# Altium project Acoustics Single Channel.PrjPcb
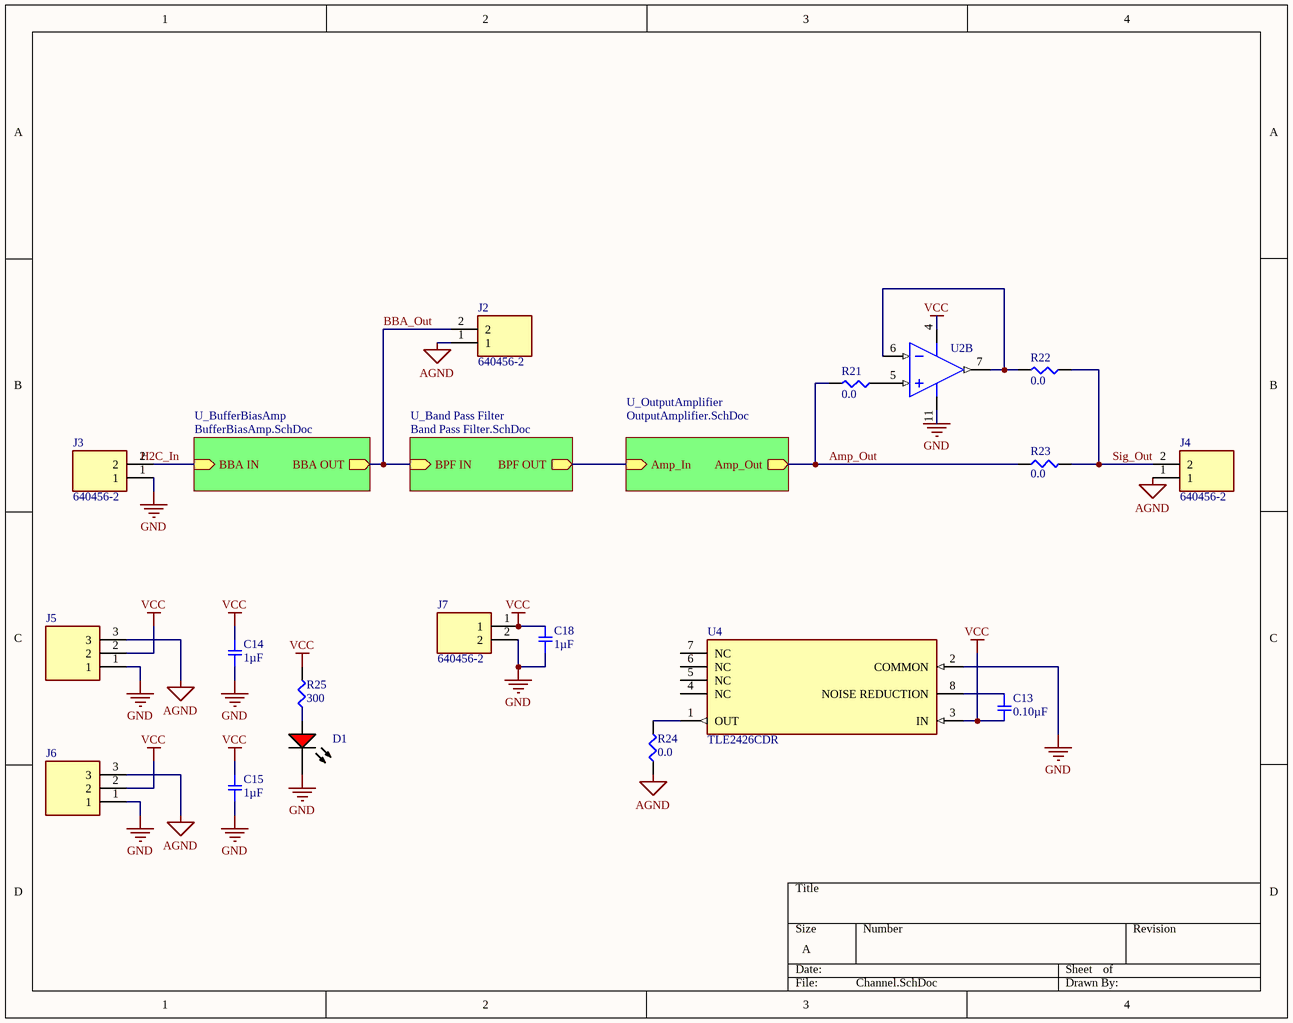
[diagram p0: Channel.SchDoc]
4 sheets, 56 parts. Net scope: hierarchical (ports join the sheet entries above them; power ports are global).
Board file: AcousticsSingleChannel.PcbDoc
Sheets:
  Channel.SchDoc
    U_OutputAmplifier = OutputAmplifier.SchDoc
    U_Band Pass Filter = Band Pass Filter.SchDoc
    U_BufferBiasAmp = BufferBiasAmp.SchDoc

## Sheet Channel.SchDoc
size A; SheetNumber: 1; SheetTotal: 4

### Parts
C13  0.10µF  [SMD-0603C]
C14  1µF  [SMD-0603C]
C15  1µF  [SMD-0603C]
C18  1µF  [SMD-0603C]
D1  TLMS1100-GS08  [VISH-TLMX1100_V]  (value not drawn)
J2  640456-2  [TE_640456-2]
J3  640456-2  [TE_640456-2]
J4  640456-2  [TE_640456-2]
J5  TSW-103-07-L-S  [TSW-103-XX-YY-S]  (value not drawn)
J6  TSW-103-07-L-S  [TSW-103-XX-YY-S]  (value not drawn)
J7  640456-2  [TE_640456-2]
R21  0.0  [SMD-0603-RES]
R22  0.0  [SMD-0603-RES]
R23  0.0  [SMD-0603-RES]
R24  0.0  [SMD-0603-RES]
R25  300  [SMD-0603-RES]
U2  OPA1604AIPWR  [PW0014A_N]  (value not drawn)  (part B of 4)
U4  TLE2426CDR  [FP-D0008A-IPC_B]

### Sub-sheets
U_Band Pass Filter = Band Pass Filter.SchDoc: BPF IN (in), BPF OUT (out)
U_BufferBiasAmp = BufferBiasAmp.SchDoc: BBA IN (in), BBA OUT (out)
U_OutputAmplifier = OutputAmplifier.SchDoc: Amp_In (in), Amp_Out (out)

### Nets
AGND: J2.1 J4.1 J5.3 J6.3 R24.1
GND: C14.1 C15.1 C18.1 D1.2(K) J3.1 J5.1 J6.1 J7.2 U2.11(V-) U4.2(COMMON)
VCC: C13.2 C14.2 C15.2 C18.2 J5.2 J6.2 J7.1 R25.2 U2.4(V+) U4.3(IN)
Amp_Out: R21.2 R23.1 ; sheet U_OutputAmplifier/Amp_Out
BBA_Out: J2.2 ; sheet U_Band Pass Filter/BPF IN, sheet U_BufferBiasAmp/BBA OUT
F4_Out: sheet U_OutputAmplifier/Amp_In, sheet U_Band Pass Filter/BPF OUT
H2C_In: J3.2 ; sheet U_BufferBiasAmp/BBA IN
Sig_Out: J4.2 R22.1 R23.2
NetC13_1: C13.1 U4.8(NOISE_REDUCTION)
NetD1_1: D1.1(A) R25.1
NetR21_1: R21.1 U2.5(IN_B+)
NetR22_2: R22.2 U2.6(IN_B-) U2.7(OUT_B)
NetR24_2: R24.2 U4.1(OUT)

Not connected (* = marked no-connect by the designer): U4 4(NC) 5(NC) 6(NC) 7(NC)

### Notes on the sheet
- Labels drawn without touching a wire or pin: H2C_In

### Library data of the parts
C13 = GCJ188R71C104KA01D: CAP CER 0.1UF 16V X7R 0603; Manufacturer: Samsung Electro-Mechanics; Manufacturer Part Number: CL10B104KB8NNWC; Value: 0.10µF; Operating Temperature: -55°C ~ 125°C; Package / Case: 0603 (1608 Metric); Datasheet Link: https://www.digikey.com/en/products/detail/samsung-electro-mechanics/CL10B104KB8NNWC/3887593
C14 C15 C18 = GCM188R71C105KA64D: CAP CER 1UF 16V X7R 0603; Manufacturer: Samsung Electro-Mechanics; Manufacturer Part Number: CL10A105KA8NNNC; Value: 1µF; Operating Temperature: -55°C ~ 125°C; Package / Case: 0603 (1608 Metric); Datasheet Link: https://www.digikey.com/en/products/detail/samsung-electro-mechanics/CL10A105KA8NNNC/3886760
D1 = CMP-1666-00027-1: LED, RED, 2.1 V, -40 to 100 degC, 2-Pin SMD (0603), RoHS, Tape and Reel; Manufacturer: Wurth Elektronics; Manufacturer Part Number: 150080SS75000; Value: 1.9V; Datasheet Link: https://www.mouser.com/ProductDetail/Wurth-Elektronik/150080SS75000?qs=LlUlMxKIyB2zzpiaOzrUdw%3D%3D&mgh=1&gclid=Cj0KCQjwm6KUBhC3ARIsACIwxBhChbj4MsdASq_HKZ9IIHp_SBsI6cWeNQVHWnPWPX4ZaUjtoXFUdFUaAm30EALw_wcB; Operating Temperature: -40to85degC; Package / Case: 0805 (2012 Metric); RoHS: Pb-Free
J2 J4 J7 = 640456-2: Connector Header Through Hole 2 position 0.100 _2.54mm_; MF: TE Connectivity; Package: None; Availability: Unavailable; TE_purchase_URL: https://www.te.com/usa-en/product-640456-2.html?te_bu=Cor&te_type=disp&te_campaign=seda_glo_cor-seda-global-disp-prtnr-fy19-seda-model-bom-cta_sma-317_1&elqCampaignId=32493; MP: 640456-2; Value: *; EU_RoHS_Compliance: Compliant; SnapEDA_Link: https://www.snapeda.com/parts/640456-2/TE%20Connectivity%20AMP%20Connectors/view-part/1957547/?ref=snap; Price: None
J3 = 640456-2: Connector Header Through Hole 2 position 0.100 _2.54mm_ Keyed; MF: TE Connectivity; Package: None; Availability: Unavailable; TE_purchase_URL: https://www.te.com/usa-en/product-640456-2.html?te_bu=Cor&te_type=disp&te_campaign=seda_glo_cor-seda-global-disp-prtnr-fy19-seda-model-bom-cta_sma-317_1&elqCampaignId=32493; MP: 640456-2; Value: *; EU_RoHS_Compliance: Compliant; SnapEDA_Link: https://www.snapeda.com/parts/640456-2/TE%20Connectivity%20AMP%20Connectors/view-part/1957547/?ref=snap; Price: None
J5 J6 = TSW-103-07-L-S: 1x3 2.54" pitch; Manufacturer_Name: SAMTEC; Datasheet Link: http://suddendocs.samtec.com/prints/tsw-xxx-xx-xxx-x-xx-xxx-mkt.pdf; Manufacturer_Part_Number: TSW-103-07-L-S
R21-R24 = ERJ-3GEY0R00V: RES SMD 0.0OHM JUMPER 1/10W 0603; Manufacturer: Stackpole Electronics Inc; Manufacturer Part Number: RMCF0603ZT0R00; Value: 0.0; Operating Temperature: -55°C ~ 155°C; Package / Case: 0603 (1608 Metric); Datasheet Link: https://www.digikey.com/en/products/detail/stackpole-electronics-inc/RMCF0603ZT0R00/1756908
R25 = ERJ-3EKF3000V: RES SMD 300 OHM 1% 1/10W 0603; Manufacturer: Panasonic Electronic Components; Value: 300; Operating Temperature: -55°C ~ 155°C; Package / Case: 0603 (1608 Metric); Datasheet Link: https://www.digikey.com/en/products/detail/panasonic-electronic-components/ERJ-3EKF3000V/1746363; Manufacturer Part Number: ERJ-3EKF3000V
U2 = CMP-0272-01731-3: Sound Plus High-Performance, Bipolar-Input Audio Operational Amplifier, 4.5 to 36 V, -40 to 85 degC, 14-pin SOP (PW14), Green (RoHS & no Sb/Br); Manufacturer: Texas Instruments; Datasheet Link: https://www.digikey.com/en/products/detail/texas-instruments/OPA1604AIPWR/2793768; Manufacturer Part Number: OPA1604AIPWR; Operating Temperature: -40°C ~ 85°C; Package / Case: 14-TSSOP
U4 = CMP-04916-000011-1: Ground Reference (Virtual) Voltage Reference IC Adjustable 2V 20 VV ±1% 20 mA 8-SOIC; Manufacturer: Texas Instruments; Manufacturer Part Number: TLE2426MD; Value: N/A; Operating Temperature: -55°C ~ 125°C; Datasheet Link: https://www.digikey.com/en/products/detail/texas-instruments/TLE2426MD/1676989; Package / Case: 8-SOIC

## Sheet OutputAmplifier.SchDoc
size A; SheetNumber: 4; SheetTotal: 4
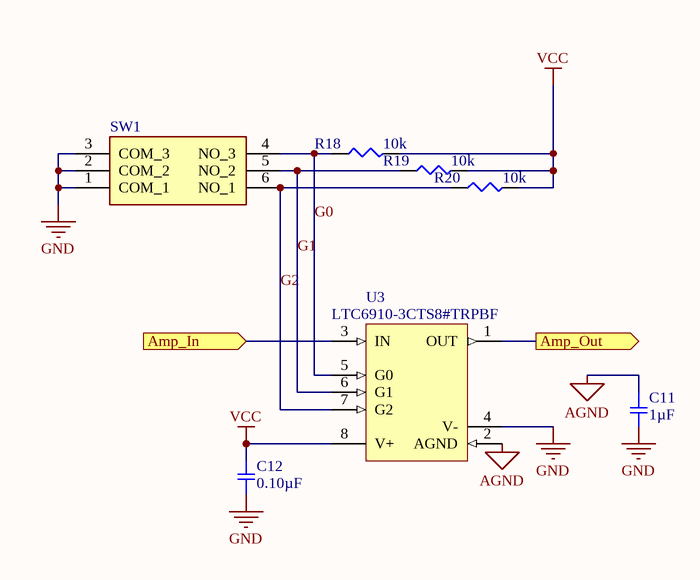
[diagram p1: OutputAmplifier.SchDoc]

### Parts
C11  1µF  [SMD-0603C]
C12  0.10µF  [SMD-0603C]
R18  10k  [SMD-0603-RES]
R19  10k  [SMD-0603-RES]
R20  10k  [SMD-0603-RES]
SW1  416131160803  [416131160803]  (value not drawn)
U3  LTC6910-3CTS8#TRPBF  [LT-TS8-8-TSOT-23_V]

### Ports
Amp_In (in), Amp_Out (out)

### Nets
AGND: C11.1 U3.2(AGND)
GND: C11.2 C12.1 SW1.1(COM_1) SW1.2(COM_2) SW1.3(COM_3) U3.4(V-)
VCC: C12.2 R18.2 R19.2 R20.2 U3.8(V+)
Amp_Out: U3.1(OUT) ; port Amp_Out
F4_Out: U3.3(IN) ; port Amp_In
G0: R18.1 SW1.4(NO_3) U3.5(G0)
G1: R19.1 SW1.5(NO_2) U3.6(G1)
G2: R20.1 SW1.6(NO_1) U3.7(G2)

### Library data of the parts
C11 = GCM188R71C105KA64D: CAP CER 1UF 16V X7R 0603; Manufacturer: Murata Electronics North America; Factory Stock: 0; Unit Price (USD): 0.24; Minimum Quantity: 1; Tolerance: ±10%; Datasheets: http://www.murata.com/~/media/webrenewal/support/library/catalog/products/capacitor/mlcc/c03e.ashx; Image: //media.digikey.com/Renders/Murata%20Renders/0603%28GCM188%29.jpg; Digi-Key Part Number: 490-5241-1-ND; Part Number: GCM188R71C105KA64D; Quantity Available: 9243; @ qty: 0; Packaging: Cut Tape (CT); Series: GCM; Part Status: Active; Value: 1µF; Voltage: 16V; Temperature Coefficient: X7R; Operating Temperature: -55°C ~ 125°C; Features: -; Ratings: AEC-Q200; Applications: Automotive; Mounting Type: Surface Mount, MLCC; Package / Case: 0603 (1608 Metric); Size / Dimension: 0.063" L x 0.031" W (1.60mm x 0.80mm); Height - Seated (Max): -; Thickness (Max): 0.035" (0.90mm); Lead Spacing: -; Lead Style: -
C12 = GCJ188R71C104KA01D: CAP CER 0.1UF 16V X7R 0603; Manufacturer: Murata Electronics North America; Factory Stock: 0; Unit Price (USD): 0.21; Minimum Quantity: 1; Tolerance: ±10%; Datasheets: http://www.murata.com/~/media/webrenewal/support/library/catalog/products/capacitor/mlcc/c03e.ashx; Image: //media.digikey.com/Renders/Murata%20Renders/0603%28LQG18%29.jpg; Digi-Key Part Number: 490-5796-1-ND; Part Number: GCJ188R71C104KA01D; Quantity Available: 22473; @ qty: 0; Packaging: Cut Tape (CT); Series: GCJ; Part Status: Active; Value: 0.10µF; Voltage: 16V; Temperature Coefficient: X7R; Operating Temperature: -55°C ~ 125°C; Features: Soft Termination; Ratings: AEC-Q200; Applications: Automotive, Boardflex Sensitive; Mounting Type: Surface Mount, MLCC; Package / Case: 0603 (1608 Metric); Size / Dimension: 0.063" L x 0.031" W (1.60mm x 0.80mm); Height - Seated (Max): -; Thickness (Max): 0.035" (0.90mm); Lead Spacing: -; Lead Style: -
R18-R20 = ERJ-3EKF1002V: RES SMD 10K OHM 1% 1/10W 0603; Manufacturer: Panasonic Electronic Components; Manufacturer Part Number: RNCP0603FTD10K0; Value: 10k; Operating Temperature: -55°C ~ 155°C; Package / Case: 0603 (1608 Metric); Datasheet Link: https://www.digikey.com/en/products/detail/stackpole-electronics-inc/RNCP0603FTD10K0/2240139
SW1 = 416131160803: Switch; Manufacturer_Name: Wurth Elektronik; Datasheet Link: https://www.we-online.com/catalog/datasheet/416131160803.pdf; Height: 2.65mm; Manufacturer_Part_Number: 416131160803; Mouser Part Number: 710-416131160803; Mouser Price/Stock: https://www.mouser.co.uk/ProductDetail/Wurth-Elektronik/416131160803?qs=2kOmHSv6VfS5Uv9iBh18ZA%3D%3D
U3 = CMP-0359-03721-2: Manufacturer: Analog Devices Inc.; Manufacturer Part Number: LTC6910-3CTS8#TRMPBF; RoHS: Pb-Free; Value: N/A; Operating Temperature: 0°C ~ 70°C; Datasheet Link: https://www.analog.com/media/en/technical-documentation/data-sheets/6910fb.pdf; Package / Case: TSOT-23-8

## Sheet Band Pass Filter.SchDoc
size 431 x 279 mm; Organization: ORGANIZATION; Address1: ADDRESS 1; Address2: ADDRESS 2; Address3: ADDRESS 3; Address4: ADDRESS 4; Revision: -; SheetNumber: 3; SheetTotal: 4; ENG_APP_DATE: --/--/--; DSN_APP_DATE: --/--/--; CHK_APP_DATE: --/--/--
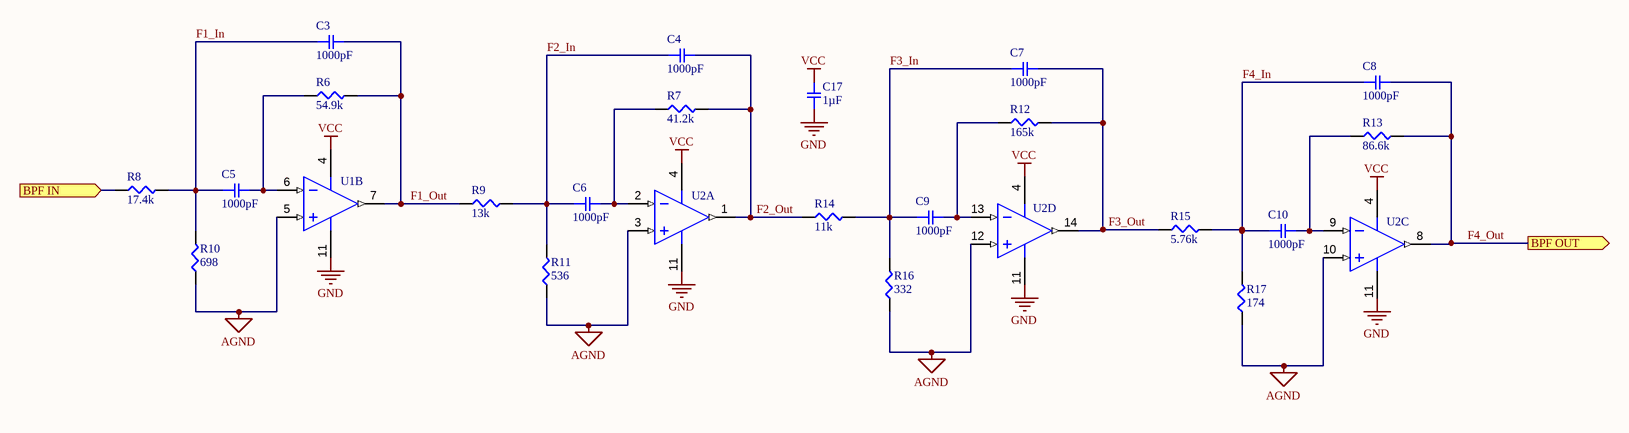
[diagram p2: Band Pass Filter.SchDoc]

### Parts
C3  1000pF  [SMD-0603C]
C4  1000pF  [SMD-0603C]
C5  1000pF  [SMD-0603C]
C6  1000pF  [SMD-0603C]
C7  1000pF  [SMD-0603C]
C8  1000pF  [SMD-0603C]
C9  1000pF  [SMD-0603C]
C10  1000pF  [SMD-0603C]
C17  1µF  [SMD-0603C]
R6  54.9k  [SMD-0603-RES]
R7  41.2k  [SMD-0603-RES]
R8  17.4k  [SMD-0603-RES]
R9  13k  [SMD-0603-RES]
R10  698  [SMD-0603-RES]
R11  536  [SMD-0603-RES]
R12  165k  [SMD-0603-RES]
R13  86.6k  [SMD-0603-RES]
R14  11k  [SMD-0603-RES]
R15  5.76k  [SMD-0603-RES]
R16  332  [SMD-0603-RES]
R17  174  [SMD-0603-RES]
U1  OPA1604AIPWR  [PW0014A_N]  (value not drawn)  (part B of 4)
U2  OPA1604AIPWR  [PW0014A_N]  (value not drawn)  (parts A,C,D of 4)

### Ports
BPF IN (in), BPF OUT (out)

### Nets
AGND: R10.1 R11.1 R16.1 R17.1 U1.5(IN_B+) U2.3(IN_A+) U2.10(IN_C+) U2.12(IN_D+)
GND: C17.1 U1.11(V-) U2.11(V-)
VCC: C17.2 U1.4(V+) U2.4(V+)
BBA_Out: R8.1 ; port BPF IN
F1_In: C3.1 C5.1 R8.2 R10.2
F1_Out: C3.2 R6.2 R9.1 U1.7(OUT_B)
F2_In: C4.1 C6.1 R9.2 R11.2
F2_Out: C4.2 R7.2 R14.1 U2.1(OUT_A)
F3_In: C7.1 C9.1 R14.2 R16.2
F3_Out: C7.2 R12.2 R15.1 U2.14(OUT_D)
F4_In: C8.1 C10.1 R15.2 R17.2
F4_Out: C8.2 R13.2 U2.8(OUT_C) ; port BPF OUT
NetC5_2: C5.2 R6.1 U1.6(IN_B-)
NetC6_2: C6.2 R7.1 U2.2(IN_A-)
NetC9_2: C9.2 R12.1 U2.13(IN_D-)
NetC10_2: C10.2 R13.1 U2.9(IN_C-)

### Notes on the sheet
- DWG. NO.
- REV.
- SHT.
- THIS DOCUMENT AND THE DATA DISCLOSED HEREIN OR HEREWITH IS THE PROPERTY OF ALTIUM LIMITED AND MAY BE FREELY DISTRIBUTED IN WHOLE. NO RIGHTS ARE RESERVED OR EXPRESS OR IMPLIED WARANTEE GIVEN.
- REVISION
- DESCRIPTION
- DATE
- APPROVED
- ENG:
- APPROVALS
- PROJECT
- DSN:
- CHK:
- REFERENCE DOCUMENTS
- PROJECT REVISION:
- TITLE
- DOCUMENT REVISION:
- DESIGN ITEM:
- BOM:
- FAB DWG:
- PCB DWG:
- ASSY DWG:
- SCALE:
- SIZE
- B
- CAGE CODE
- FILE NAME
- DWG NO.
- SHEET
- OF
- REV

### Library data of the parts
C3-C10 = GCJ188R71H102KA01D: CAP CER 1000PF 50V X7R 0603; Manufacturer: Walsin Technology Corporation; Manufacturer Part Number: 0603N102F500CT; Value: 1000pF; Operating Temperature: -55°C ~ 125°C; Package / Case: 0603 (1608 Metric); Datasheet Link: https://www.digikey.com/en/products/detail/walsin-technology-corporation/0603N102F500CT/9354972
C17 = GCM188R71C105KA64D: as C14 on sheet Channel; Value: 1µF; Operating Temperature: -55°C ~ 125°C; Package / Case: 0603 (1608 Metric); Datasheet Link: https://www.digikey.com/en/products/detail/samsung-electro-mechanics/CL10A105KA8NNNC/3886760
R6 = ERJ-3EKF5492V: RES SMD 54.9K OHM 1% 1/10W 0603; Manufacturer: Panasonic Electronic Components; Value: 54.9k; Operating Temperature: -55°C ~ 155°C; Package / Case: 0603 (1608 Metric); Datasheet Link: https://www.digikey.com/en/products/detail/panasonic-electronic-components/ERJ-3EKF5492V/196403; Manufacturer Part Number: ERJ-3EKF5492V
R7 = ERJ-3EKF4122V: RES SMD 41.2K OHM 1% 1/10W 0603; Manufacturer: Panasonic Electronic Components; Value: 41.2k; Operating Temperature: -55°C ~ 155°C; Package / Case: 0603 (1608 Metric); Datasheet Link: https://www.digikey.com/en/products/detail/yageo/RC0603FR-0741K2L/727225; Manufacturer Part Number: ERJ-3EKF4122V
R8 = ERJ-3EKF1742V: RES SMD 17.4K OHM 1% 1/10W 0603; Manufacturer: Panasonic Electronic Components; Value: 17.4k; Operating Temperature: -55°C ~ 155°C; Package / Case: 0603 (1608 Metric); Datasheet Link: https://www.digikey.com/en/products/detail/panasonic-electronic-components/ERJ-3EKF1742V/196159; Manufacturer Part Number: ERJ-3EKF1742V
R9 = ERJ-3EKF1302V: RES SMD 13K OHM 1% 1/10W 0603; Manufacturer: Panasonic Electronic Components; Value: 13k; Operating Temperature: -55°C ~ 155°C; Package / Case: 0603 (1608 Metric); Datasheet Link: https://www.digikey.com/en/products/detail/panasonic-electronic-components/ERJ-3EKF1302V/196110; Manufacturer Part Number: ERJ-3EKF1302V
R10 = ERJ-3EKF6980V: RES SMD 698 OHM 1% 1/10W 0603; Manufacturer: Panasonic Electronic Components; Value: 698; Operating Temperature: -55°C ~ 155°C; Package / Case: 0603 (1608 Metric); Datasheet Link: https://www.digikey.com/en/products/detail/panasonic-electronic-components/ERJ-3EKF6980V/196453; Manufacturer Part Number: ERJ-3EKF6980V
R11 = ERJ-3EKF5360V: RES SMD 536 OHM 1% 1/10W 0603; Manufacturer: Panasonic Electronic Components; Value: 536; Operating Temperature: -55°C ~ 155°C; Package / Case: 0603 (1608 Metric); Datasheet Link: https://www.digikey.com/en/products/detail/panasonic-electronic-components/ERJ-3EKF5360V/196400; Manufacturer Part Number: ERJ-3EKF5360V
R12 = ERJ-3EKF1653V: RES SMD 165K OHM 1% 1/10W 0603; Manufacturer: Panasonic Electronic Components; Value: 165k; Operating Temperature: -55°C ~ 155°C; Package / Case: 0603 (1608 Metric); Datasheet Link: https://www.digikey.com/en/products/detail/panasonic-electronic-components/ERJ-3EKF1653V/196155; Manufacturer Part Number: ERJ-3EKF1653V
R13 = ERJ-3EKF8662V: RES SMD 86.6K OHM 1% 1/10W 0603; Manufacturer: Panasonic Electronic Components; Value: 86.6k; Operating Temperature: -55°C ~ 155°C; Package / Case: 0603 (1608 Metric); Datasheet Link: https://www.digikey.com/en/products/detail/panasonic-electronic-components/ERJ-3EKF8662V/196500; Manufacturer Part Number: ERJ-3EKF8662V
R14 = ERJ-3EKF1102V: RES SMD 11K OHM 1% 1/10W 0603; Manufacturer: Panasonic Electronic Components; Value: 11k; Operating Temperature: -55°C ~ 155°C; Package / Case: 0603 (1608 Metric); Datasheet Link: https://www.digikey.com/en/products/detail/panasonic-electronic-components/ERJ-3EKF1102V/196083; Manufacturer Part Number: ERJ-3EKF1102V
R15 = ERJ-3EKF5761V: RES SMD 5.76K OHM 1% 1/10W 0603; Manufacturer: Panasonic Electronic Components; Value: 5.76k; Operating Temperature: -55°C ~ 155°C; Package / Case: 0603 (1608 Metric); Datasheet Link: https://www.digikey.com/en/products/detail/panasonic-electronic-components/ERJ-3EKF5761V/196388; Manufacturer Part Number: ERJ-3EKF5761V
R16 = ERJ-3EKF3320V: RES SMD 332 OHM 1% 1/10W 0603; Manufacturer: Panasonic Electronic Components; Value: 332; Operating Temperature: -55°C ~ 155°C; Package / Case: 0603 (1608 Metric); Datasheet Link: https://www.digikey.com/en/products/detail/panasonic-electronic-components/ERJ-3EKF3320V/196300; Manufacturer Part Number: ERJ-3EKF3320V
R17 = ERJ-3EKF1740V: RES SMD 174 OHM 1% 1/10W 0603; Manufacturer: Panasonic Electronic Components; Value: 174; Operating Temperature: -55°C ~ 155°C; Package / Case: 0603 (1608 Metric); Datasheet Link: https://www.digikey.com/en/products/detail/panasonic-electronic-components/ERJ-3EKF1740V/196162; Manufacturer Part Number: ERJ-3EKF1740V
U1 U2 = CMP-0272-01731-3: as U2 on sheet Channel; Datasheet Link: https://www.digikey.com/en/products/detail/texas-instruments/OPA1604AIPWR/2793768; Manufacturer Part Number: OPA1604AIPWR; Operating Temperature: -40°C ~ 85°C; Package / Case: 14-TSSOP

## Sheet BufferBiasAmp.SchDoc
size A; SheetNumber: 2; SheetTotal: 4
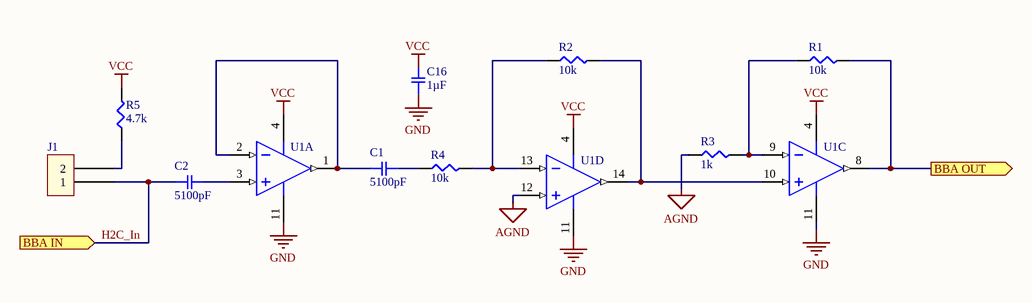
[diagram p3: BufferBiasAmp.SchDoc]

### Parts
C1  5100pF  [SMD-0603C]
C2  5100pF  [SMD-0603C]
C16  1µF  [SMD-0603C]
J1  Header  [1x2 Header]  (value not drawn)
R1  10k  [SMD-0603-RES]
R2  10k  [SMD-0603-RES]
R3  1k  [SMD-0603-RES]
R4  10k  [SMD-0603-RES]
R5  4.7k  [SMD-0603-RES]
U1  OPA1604AIPWR  [PW0014A_N]  (value not drawn)  (parts A,C,D of 4)

### Ports
BBA IN (in), BBA OUT (out)

### Nets
AGND: R3.1 U1.12(IN_D+)
GND: C16.1 U1.11(V-)
VCC: C16.2 R5.2 U1.4(V+)
BBA_Out: R1.2 U1.8(OUT_C) ; port BBA OUT
H2C_In: C2.1 J1.1 ; port BBA IN
NetC1_1: C1.1 R4.1
NetC1_2: C1.2 U1.1(OUT_A) U1.2(IN_A-)
NetC2_2: C2.2 U1.3(IN_A+)
NetJ1_2: J1.2 R5.1
NetR1_1: R1.1 R3.2 U1.9(IN_C-)
NetR2_1: R2.1 R4.2 U1.13(IN_D-)
NetR2_2: R2.2 U1.10(IN_C+) U1.14(OUT_D)

### Library data of the parts
C1 = GRM1887U1H512JA01D: CAP CER 5100PF 50V U2J 0603; Manufacturer: Murata Electronics North America; Value: 5100pF; Operating Temperature: -55°C ~ 125°C; Package / Case: 0603 (1608 Metric); Datasheet Link: https://www.digikey.com/en/products/detail/murata-electronics/GRM1887U1H512JA01D/2612102; Manufacturer Part Number: GRM1887U1H512JA01D
C2 = GRM1887U1H512JA01D: CAP CER 5100PF 50V U2J 0603; Manufacturer: Murata Electronics North America; Factory Stock: 0; Unit Price (USD): 0.2; Minimum Quantity: 1; Tolerance: ±5%; Datasheets: http://www.murata.com/~/media/webrenewal/support/library/catalog/products/capacitor/mlcc/c02e.pdf; Image: //media.digikey.com/Renders/Murata%20Renders/ZRB-SERIES-0402.jpg; Digi-Key Part Number: 490-6399-1-ND; Part Number: GRM1887U1H512JA01D; Quantity Available: 12288; @ qty: 0; Packaging: Cut Tape (CT); Series: GRM; Part Status: Active; Value: 5100pF; Voltage: 50V; Temperature Coefficient: U2J; Operating Temperature: -55°C ~ 125°C; Features: -; Ratings: -; Applications: General Purpose; Mounting Type: Surface Mount, MLCC; Package / Case: 0603 (1608 Metric); Size / Dimension: 0.063" L x 0.031" W (1.60mm x 0.80mm); Height - Seated (Max): -; Thickness (Max): 0.035" (0.90mm); Lead Spacing: -; Lead Style: -
C16 = GCM188R71C105KA64D: as C14 on sheet Channel; Value: 1µF; Operating Temperature: -55°C ~ 125°C; Package / Case: 0603 (1608 Metric); Datasheet Link: https://www.digikey.com/en/products/detail/samsung-electro-mechanics/CL10A105KA8NNNC/3886760
J1 = 1x2 Header: CONN HEADER VERT 2POS 2.54MM
R1 R2 R4 = ERJ-3EKF1002V: as R18 on sheet OutputAmplifier; Value: 10k; Operating Temperature: -55°C ~ 155°C; Package / Case: 0603 (1608 Metric); Datasheet Link: https://www.digikey.com/en/products/detail/stackpole-electronics-inc/RNCP0603FTD10K0/2240139
R3 = ERJ-3EKF1001V: RES SMD 1K OHM 1% 1/10W 0603; Manufacturer: Stackpole Electronics Inc; Manufacturer Part Number: RNCP0603FTD1K00; Value: 1k; Operating Temperature: -55°C ~ 155°C; Package / Case: 0603 (1608 Metric); Datasheet Link: https://www.digikey.com/en/products/detail/stackpole-electronics-inc/RNCP0603FTD1K00/2240106
R5 = ERJ-3EKF4701V: RES SMD 4.7K OHM 1% 1/10W 0603; Manufacturer: Panasonic Electronic Components; Value: 4.7k; Operating Temperature: -55°C ~ 155°C; Package / Case: 0603 (1608 Metric); Datasheet Link: https://www.digikey.com/en/products/detail/panasonic-electronic-components/ERJ-3EKF4701V/1746419; Manufacturer Part Number: ERJ-3EKF4701V
U1 = CMP-0272-01731-3: as U2 on sheet Channel; Datasheet Link: https://www.digikey.com/en/products/detail/texas-instruments/OPA1604AIPWR/2793768; Manufacturer Part Number: OPA1604AIPWR; Operating Temperature: -40°C ~ 85°C; Package / Case: 14-TSSOP

## Nets that join several sheets
AGND: Channel (5 pins), OutputAmplifier (C11.1 U3.2), Band Pass Filter (8 pins), BufferBiasAmp (R3.1 U1.12)
GND: Channel (10 pins), OutputAmplifier (6 pins), Band Pass Filter (C17.1 U1.11 U2.11), BufferBiasAmp (C16.1 U1.11)
VCC: Channel (10 pins), OutputAmplifier (5 pins), Band Pass Filter (C17.2 U1.4 U2.4), BufferBiasAmp (C16.2 R5.2 U1.4)
Amp_Out: Channel (R21.2 R23.1), OutputAmplifier (U3.1)
BBA_Out: Channel (J2.2), Band Pass Filter (R8.1), BufferBiasAmp (R1.2 U1.8)
F4_Out: OutputAmplifier (U3.3), Band Pass Filter (C8.2 R13.2 U2.8)
H2C_In: Channel (J3.2), BufferBiasAmp (C2.1 J1.1)